# Altium schematic sheet DCSource5V0.SchDoc
size A4; DocumentNumber: 5; SheetNumber: 5; SheetTotal: 5
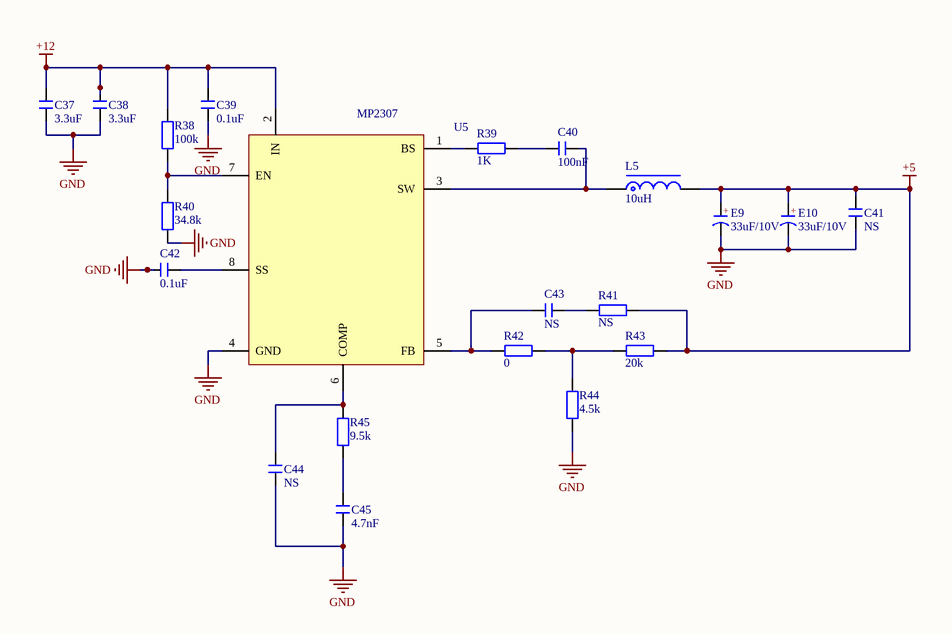
[diagram p0: DCSource5V0.SchDoc]

## Parts
C37  3.3uF  [C 0805_L]
C38  3.3uF  [C 0805_L]
C39  0.1uF  [C 0805_L]
C40  100nF  [C 0805_L]
C41  NS  [C 0805_L]
C42  0.1uF  [C 0805_L]
C43  NS  [C 0805_L]
C44  NS  [C 0805_L]
C45  4.7nF  [C 0805_L]
E9  33uF/10V  [CT 5*6 - C]
E10  33uF/10V  [CT 5*6 - C]
L5  10uH  [CD31]
R38  100k  [R 0805_L]
R39  1K  [R 0805_L]
R40  34.8k  [R 0805_L]
R41  NS  [R 0805_L]
R42  0  [R 0805_L]
R43  20k  [R 0805_L]
R44  4.5k  [R 0805_L]
R45  9.5k  [R 0805_L]
U5  MP2307  [SOP8_M]

## Nets
+5: C41.2 E9.1(A) E10.1(A) L5.2 R41.1 R43.2
+12: C37.2 C38.2 C39.2 R38.2 U5.2(IN)
GND: C37.1 C38.1 C39.1 C41.1 C42.2 C44.1 C45.1 E9.2(K) E10.2(K) R40.1 R44.1 U5.4(GND)
NetC40_1: C40.1 R39.2
NetC40_2: C40.2 L5.1 U5.3(SW)
NetC42_1: C42.1 U5.8(SS)
NetC43_1: C43.1 R42.1 U5.5(FB)
NetC43_2: C43.2 R41.2
NetC44_2: C44.2 R45.2 U5.6(COMP)
NetC45_2: C45.2 R45.1
NetR38_1: R38.1 R40.2 U5.7(EN)
NetR39_1: R39.1 U5.1(BS)
NetR42_2: R42.2 R43.1 R44.2

## Notes on the sheet
- (in symbol C-CT) +

## Library data of the parts
C37-C45 = C: 无极性贴片电容; 材质: X7R; BOM名称: 无极性贴片电容
E9 E10 = C-CT: 贴片固态电容; BOM名称: 贴片固态电容
L5 = L-CD: 贴片功率电感; BOM名称: 功率电感
R38-R45 = R: 贴片电阻; BOM名称: 贴片电阻
U5 = Component_1